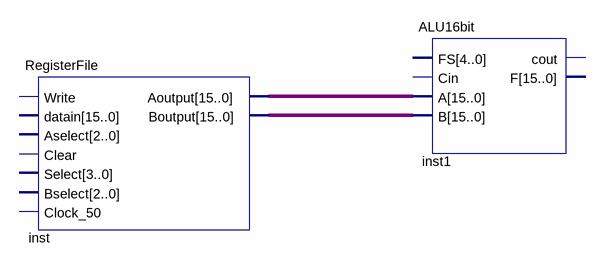
[diagram p0: schematic sheet]
// Quartus schematic CompArchProcessor.bdf as structural Verilog: 2 symbols, 0 pins
module CompArchProcessor (
);

  wire [15:0] inst_aoutput, inst_boutput;

  RegisterFile inst (
    .Aoutput(inst_aoutput), .Boutput(inst_boutput));  // open: Write, datain, Aselect, Clear, Select, Bselect, Clock_50
  ALU16bit inst1 (.A(inst_aoutput), .B(inst_boutput));  // open: FS, Cin, cout, F
endmodule
